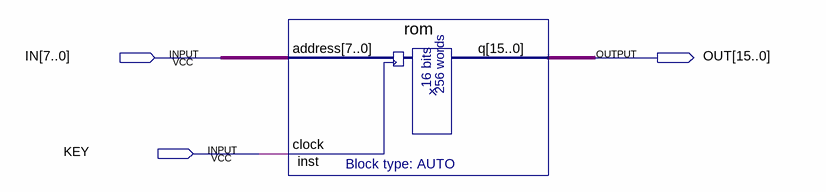
[diagram p0: schematic sheet]
// Quartus schematic ROM2.bdf as structural Verilog: 1 symbols, 3 pins
module ROM2 (
  input  [7:0] IN,
  input  KEY,
  output [15:0] OUT
);

  rom inst (.address(IN), .clock(KEY), .q(OUT));
endmodule
